# Altium schematic sheet 04_ANALOG_2.SchDoc
size A4
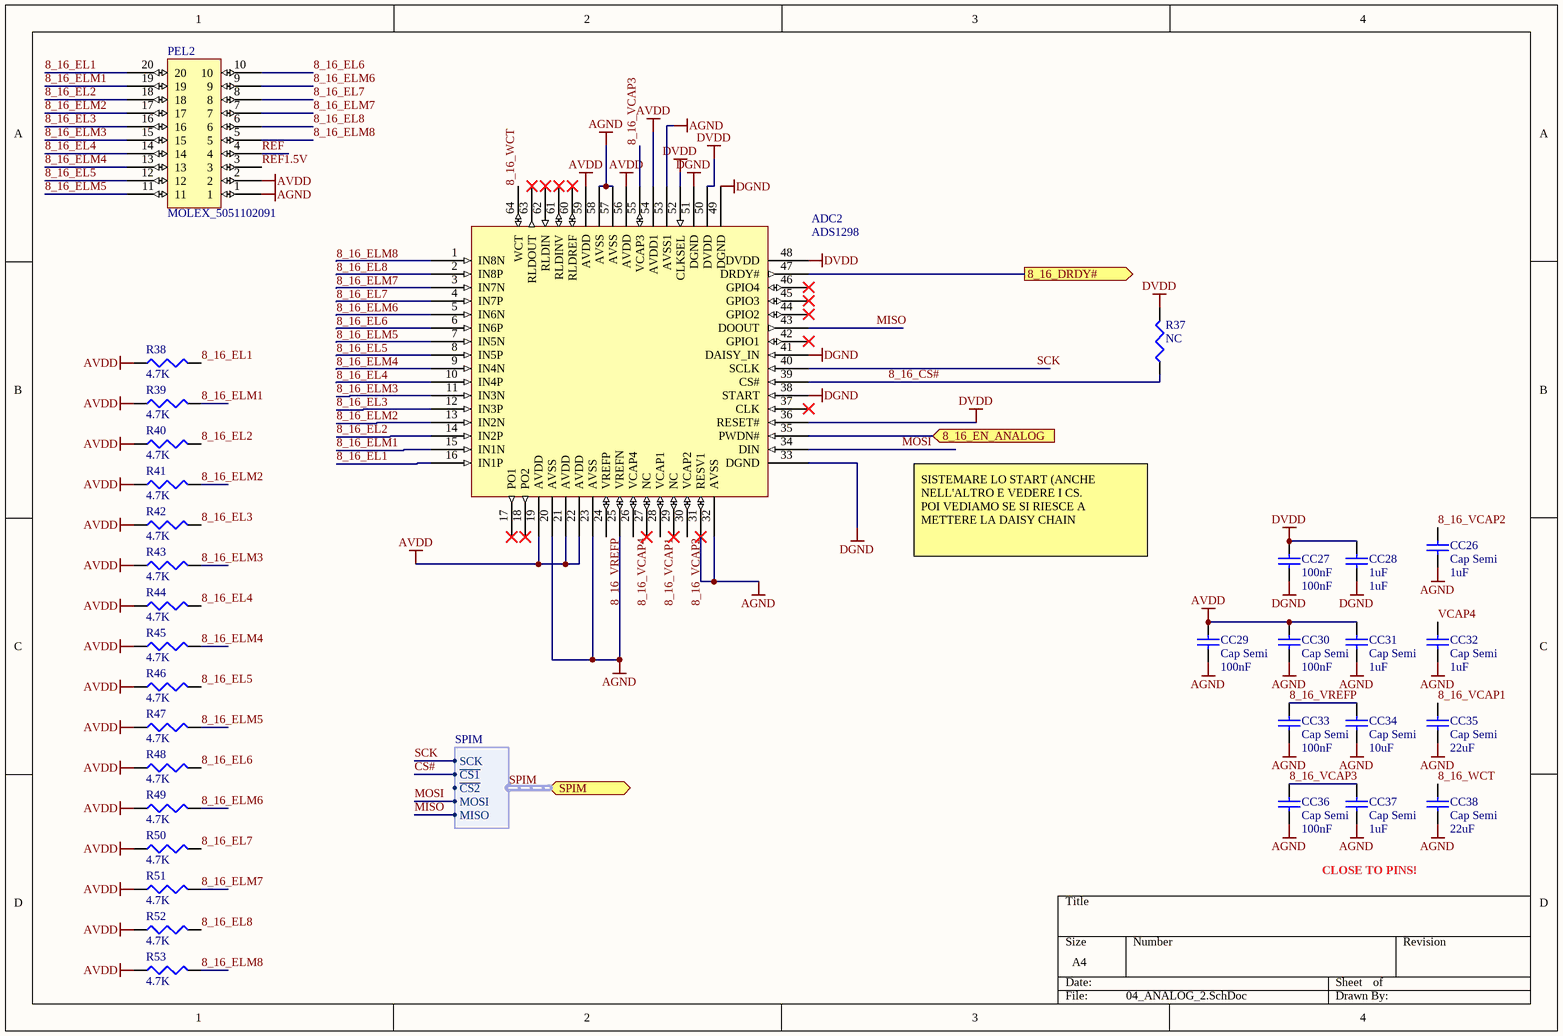
[diagram p0: 04_ANALOG_2.SchDoc]

## Parts
ADC2  ADS1298  [S-PQFP - G64 - ADS1298]
CC26  Cap Semi  value 1uF  [0402]
CC27  100nF  [0402]
CC28  1uF  [0402]
CC29  Cap Semi  value 100nF  [0402]
CC30  Cap Semi  value 100nF  [0402]
CC31  Cap Semi  value 1uF  [0402]
CC32  Cap Semi  value 1uF  [0402]
CC33  Cap Semi  value 100nF  [0402]
CC34  Cap Semi  value 10uF  [0402]
CC35  Cap Semi  value 22uF  [J1-0603]
CC36  Cap Semi  value 100nF  [0402]
CC37  Cap Semi  value 1uF  [0402]
CC38  Cap Semi  value 22uF  [1608[0603]]
PEL2  MOLEX_5051102091  [MOLEX_5051102091]
R37  NC  [0402]
R38  4.7K  [0402]
R39  4.7K  [0402]
R40  4.7K  [0402]
R41  4.7K  [0402]
R42  4.7K  [0402]
R43  4.7K  [0402]
R44  4.7K  [0402]
R45  4.7K  [0402]
R46  4.7K  [0402]
R47  4.7K  [0402]
R48  4.7K  [0402]
R49  4.7K  [0402]
R50  4.7K  [0402]
R51  4.7K  [0402]
R52  4.7K  [0402]
R53  4.7K  [0402]

## Ports
8_16_DRDY# (out), 8_16_EN_ANALOG (in), SPIM (harness SPIM)

## Harnesses
SPIM: SCK, ~{CS1}, ~{CS2}, MOSI, MISO

## Nets
AGND: ADC2.20(AVSS) ADC2.23(AVSS) ADC2.25(VREFN) ADC2.31(RESV1) ADC2.32(AVSS) ADC2.53(AVSS1) ADC2.57(AVSS) ADC2.58(AVSS) CC26.1 CC29.1 CC30.1 CC31.1 CC32.1 CC33.1 CC34.1 CC35.1 CC36.1 CC37.1 CC38.1 PEL2.1
AVDD: ADC2.19(AVDD) ADC2.21(AVDD) ADC2.22(AVDD) ADC2.54(AVDD1) ADC2.56(AVDD) ADC2.59(AVDD) CC29.2 CC30.2 CC31.2 PEL2.2 R38.1 R39.1 R40.1 R41.1 R42.1 R43.1 R44.1 R45.1 R46.1 R47.1 R48.1 R49.1 R50.1 R51.1 R52.1 R53.1
DGND: ADC2.33(DGND) ADC2.38(START) ADC2.41(DAISY_IN) ADC2.49(DGND) ADC2.51(DGND) CC27.1 CC28.1
DVDD: ADC2.36(RESET#) ADC2.48(DVDD) ADC2.50(DVDD) ADC2.52(CLKSEL) CC27.2 CC28.2 R37.2
8_16_CS#: ADC2.39(CS#) R37.1
8_16_DRDY#: ADC2.47(DRDY#) ; port 8_16_DRDY#
8_16_EL1: ADC2.16(IN1P) PEL2.20 R38.2
8_16_EL2: ADC2.14(IN2P) PEL2.18 R40.2
8_16_EL3: ADC2.12(IN3P) PEL2.16 R42.2
8_16_EL4: ADC2.10(IN4P) PEL2.14 R44.2
8_16_EL5: ADC2.8(IN5P) PEL2.12 R46.2
8_16_EL6: ADC2.6(IN6P) PEL2.10 R48.2
8_16_EL7: ADC2.4(IN7P) PEL2.8 R50.2
8_16_EL8: ADC2.2(IN8P) PEL2.6 R52.2
8_16_ELM1: ADC2.15(IN1N) PEL2.19 R39.2
8_16_ELM2: ADC2.13(IN2N) PEL2.17 R41.2
8_16_ELM3: ADC2.11(IN3N) PEL2.15 R43.2
8_16_ELM4: ADC2.9(IN4N) PEL2.13 R45.2
8_16_ELM5: ADC2.7(IN5N) PEL2.11 R47.2
8_16_ELM6: ADC2.5(IN6N) PEL2.9 R49.2
8_16_ELM7: ADC2.3(IN7N) PEL2.7 R51.2
8_16_ELM8: ADC2.1(IN8N) PEL2.5 R53.2
8_16_EN_ANALOG: ADC2.35(PWDN#) ; port 8_16_EN_ANALOG
8_16_VCAP1: ADC2.28(VCAP1) CC35.2
8_16_VCAP2: ADC2.30(VCAP2) CC26.2
8_16_VCAP3: ADC2.55(VCAP3) CC36.2 CC37.2
8_16_VCAP4: ADC2.26(VCAP4)
8_16_VREFP: ADC2.24(VREFP) CC33.2 CC34.2
8_16_WCT: ADC2.64(WCT) CC38.2
CS#: port SPIM.~{CS1}
MISO: ADC2.43(DOOUT) ; port SPIM.MISO
MOSI: ADC2.34(DIN) ; port SPIM.MOSI
REF: PEL2.4
REF1.5V: PEL2.3
SCK: ADC2.40(SCLK) ; port SPIM.SCK
VCAP4: CC32.2

Not connected (* = marked no-connect by the designer): ADC2 17(PO1)* 18(PO2)* 27(NC)* 29(NC)* 37(CLK)* 42(GPIO1)* 44(GPIO2)* 45(GPIO3)* 46(GPIO4)* 60(RLDREF)* 61(RLDINV)* 62(RLDIN)* 63(RLDOUT)*

## Buses and harness runs
harness SPIM = port SPIM

## Notes on the sheet
- SISTEMARE LO START (ANCHE NELL'ALTRO E VEDERE I CS.
  POI VEDIAMO SE SI RIESCE A METTERE LA DAISY CHAIN
- CLOSE TO PINS!

## Library data of the parts
CC26-CC38 = Cap Semi: Capacitor (Semiconductor SIM Model); Published: 8-Jun-2000; LatestRevisionDate: 29-May-2009; LatestRevisionNote: IPC-7351 Footprint Added.; PackageReference: C1206; Publisher: Altium Limited; PackageDescription: Chip Capacitor
  CC27: Value: 100nF
  CC28: Value: 1uF
R37-R53 = Res3: Resistor; Published: 8-Jun-2000; LatestRevisionDate: 29-May-2009; LatestRevisionNote: IPC-7351 Footprint Added.; PackageReference: J1-0603; Publisher: Altium Limited; PackageDescription: Chip Resistor
  R37: Value: NC
  R38-R53: Value: 4.7K